# EAGLE design T_Ringmod (EAGLE 6.3)
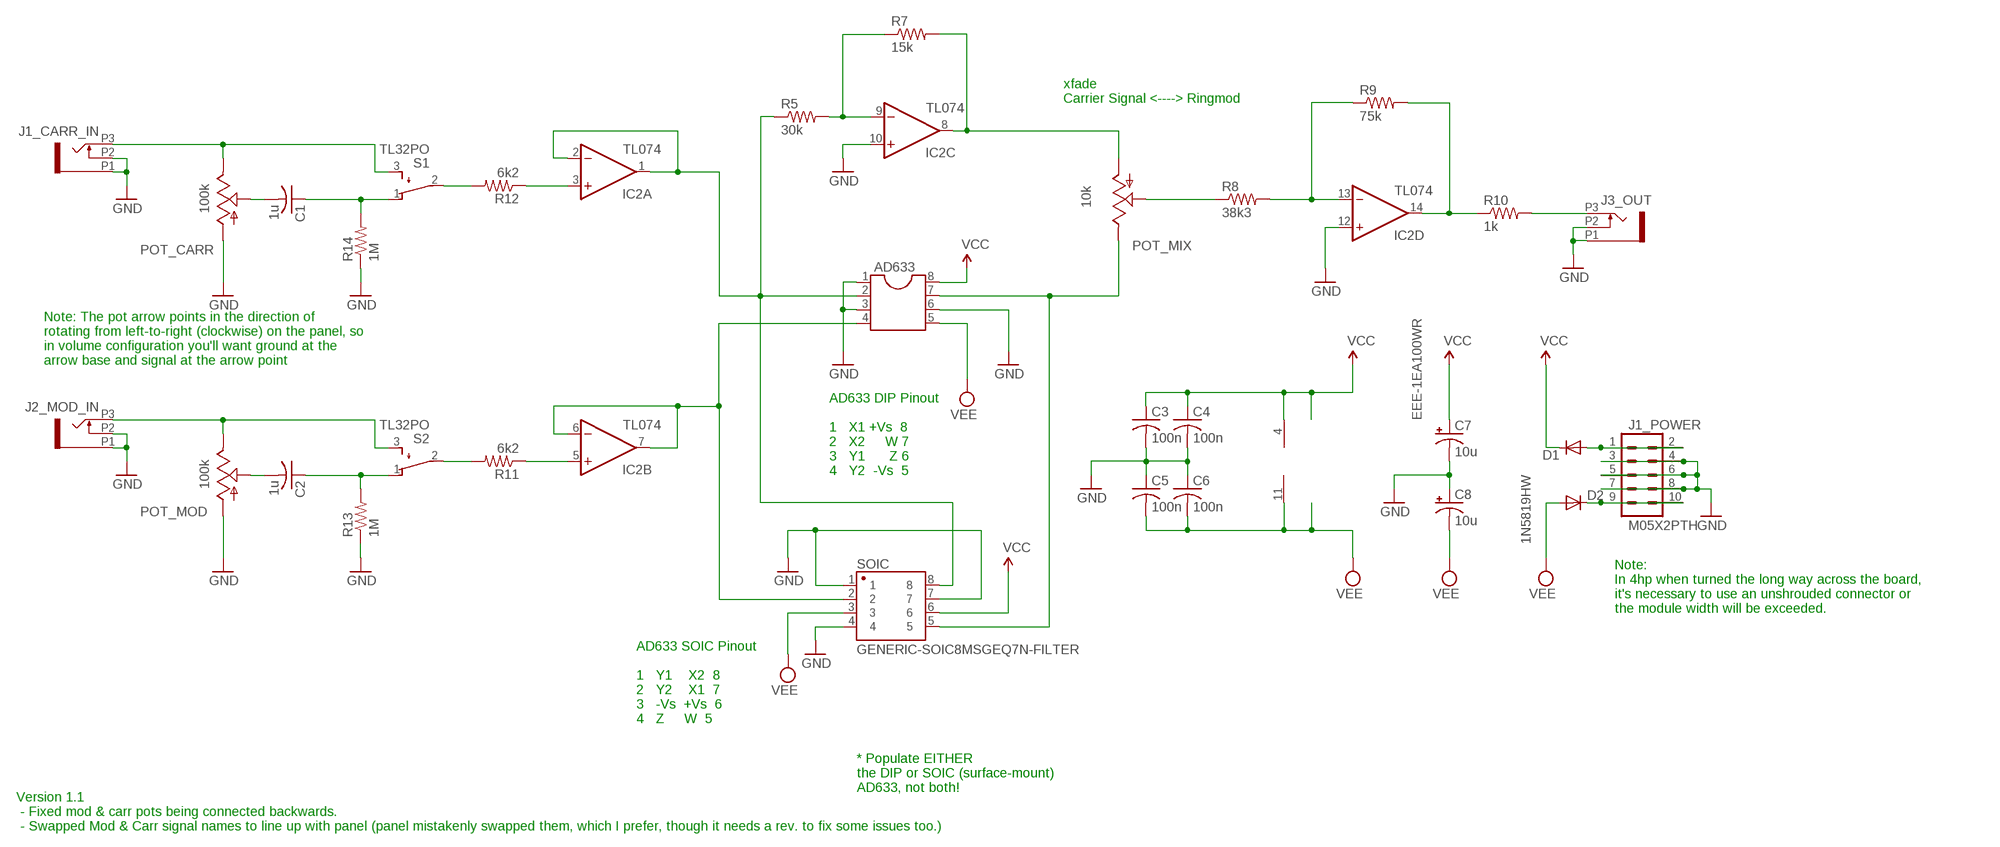
[diagram p0: schematic, sheet 1]

## Parts
AD633  DIL8  [DIL08]
C1  1u  C-USC0805  [C0805]
C2  1u  C-USC0805  [C0805]
C3  100n  C-USC0805  [C0805]
C4  100n  C-USC0805  [C0805]
C5  100n  C-USC0805  [C0805]
C6  100n  C-USC0805  [C0805]
C7  10u  CPOL-USA  [PANASONIC_A]
C8  10u  CPOL-USA  [PANASONIC_A]
D1  1N5819HW  DIODE-SOD123  [SOD123]
D2  1N5819HW  DIODE-SOD123  [SOD123]
IC2  TL074  TL074D  [SO14]
J1_CARR_IN  PJ301_THONKICONN6  [WQP_PJ_301M6]
J1_POWER  M05X2PTH  [AVR_ICSP]
J2_MOD_IN  PJ301_THONKICONN6  [WQP_PJ_301M6]
J3_OUT  PJ301_THONKICONN6  [WQP_PJ_301M6]
POT_CARR  100k  POT_USVERTICAL_PS  [ALPS_POT_VERTICAL_PS]
POT_MIX  10k  POT_USVERTICAL_PS  [ALPS_POT_VERTICAL_PS]
POT_MOD  100k  POT_USVERTICAL_PS  [ALPS_POT_VERTICAL_PS]
R5  30k  R-US_R0805  [R0805]
R7  15k  R-US_R0805  [R0805]
R8  38k3  R-US_R0805  [R0805]
R9  75k  R-US_R0805  [R0805]
R10  1k  R-US_R0805  [R0805]
R11  6k2  R-US_R0805  [R0805]
R12  6k2  R-US_R0805  [R0805]
R13  1M  R-US_R0805  [R0805]
R14  1M  R-US_R0805  [R0805]
S1  TL32PO  [TL3XPO]
S2  TL32PO  [TL3XPO]
SOIC  GENERIC-SOIC8MSGEQ7N-FILTER  [SO08]

## Nets
GND: AD633.1 AD633.3 AD633.6 C3.2 C4.2 C5.1 C6.1 C7.- C8.+ IC2.10(C:+IN) IC2.12(D:+IN) J1_CARR_IN.P1 J1_CARR_IN.P2 J1_POWER.3 J1_POWER.4 J1_POWER.5 J1_POWER.6 J1_POWER.7 J1_POWER.8 J2_MOD_IN.P1 J2_MOD_IN.P2 J3_OUT.P1 J3_OUT.P2 POT_CARR.P$3(A) POT_MOD.P$3(A) R13.1 R14.1 SOIC.1 SOIC.4 SOIC.7
N$1: C2.2 POT_MOD.P$2(S)
N$2: C1.2 POT_CARR.P$2(S)
N$3: C1.1 R14.2 S1.1(O)
N$4: R12.2 S1.2(P)
N$5: IC2.3(A:+IN) R12.1
N$6: D1.A J1_POWER.1 J1_POWER.2
N$7: AD633.2 IC2.1(A:OUT) IC2.2(A:-IN) R5.1 SOIC.8
N$8: IC2.5(B:+IN) R11.1
N$9: R11.2 S2.2(P)
N$10: C2.1 R13.2 S2.1(O)
N$12: AD633.4 IC2.6(B:-IN) IC2.7(B:OUT) SOIC.2
N$13: IC2.9(C:-IN) R5.2 R7.1
N$14: IC2.8(C:OUT) POT_MIX.P$3(A) R7.2
N$15: AD633.7 POT_MIX.P$1(E) SOIC.5
N$16: J2_MOD_IN.P3 POT_MOD.P$1(E) S2.3(S)
N$17: J1_CARR_IN.P3 POT_CARR.P$1(E) S1.3(S)
N$18: POT_MIX.P$2(S) R8.1
N$19: IC2.13(D:-IN) R8.2 R9.1
N$20: D2.C J1_POWER.9 J1_POWER.10
N$21: IC2.14(D:OUT) R9.2 R10.1
N$22: J3_OUT.P3 R10.2
VCC: AD633.8 C3.1 C4.1 C7.+ D1.C IC2.4(P:V+) SOIC.6
VEE: AD633.5 C5.2 C6.2 C8.- D2.A IC2.11(P:V-) SOIC.3

## Notes on the sheet
- xfade
  Carrier Signal <----> Ringmod
- Note: The pot arrow points in the direction of 
  rotating from left-to-right (clockwise) on the panel, so
  in volume configuration you'll want ground at the
  arrow base and signal at the arrow point
- EEE-1EA100WR
- AD633 DIP Pinout
  
  1   X1	+Vs  8
  2   X2	    W 7
  3   Y1	     Z 6
  4   Y2	 -Vs  5
- Note:
  In 4hp when turned the long way across the board,
  it's necessary to use an unshrouded connector or
  the module width will be exceeded.
- AD633 SOIC Pinout
  
  1   Y1	   X2  8
  2   Y2	   X1  7
  3   -Vs	 +Vs  6
  4   Z	    W  5
- Version 1.1
   - Fixed mod & carr pots being connected backwards.
   - Swapped Mod & Carr signal names to line up with panel (panel mistakenly swapped them, which I prefer, though it needs a rev. to fix some issues too.)
- * Populate EITHER
  the DIP or SOIC (surface-mount)
  AD633, not both!

## Library data of the parts
AD633 = ic-package:DIL8: Dual In Line / Socket
C1-C6 = rcl:C-US: CAPACITOR, American symbol
C7 C8 = rcl:CPOL-US: POLARIZED CAPACITOR, American symbol
D1 D2 = diode:DIODE-: DIODE
IC2 = linear:TL074: OP AMP
J1_CARR_IN J2_MOD_IN J3_OUT = og-pj301:PJ301_THONKICONN
J1_POWER = og-header:M05X2: Header 5x2 Standard 10-pin dual row 0.1" header. Commonly used with AVR-ISP. Use with Spark Fun Electronics SKU: PRT-00778
POT_CARR POT_MIX POT_MOD = pot-alps:POT_US
R5 R7-R14 = resistor:R-US_: RESISTOR, American symbol
S1 S2 = switch:TL32PO: TINY SWITCH ON - MOM Source: http://www2.produktinfo.conrad.com/datenblaetter/700000-724999/705152-da-01-de-Subminiaturschalter_TL_36YO.pdf
SOIC = SparkFun-Retired:GENERIC-SOIC8: A placeholder for generic narrow & wide SOIC8 foorptints - used on the DIP adapter board. Has strange reference to IC-10141, a Seven Band Graphic Equalizer Display Filter SOIC-8 VFP: IC-10141; PROD_ID: IC-10141

## Board
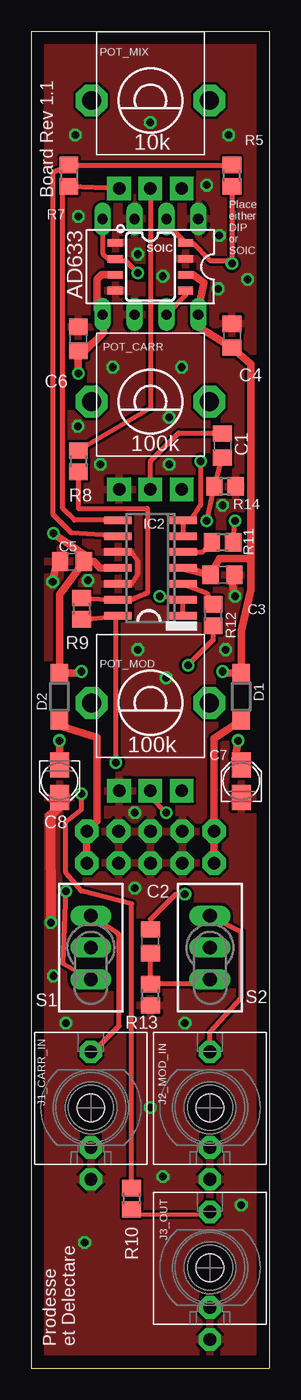
[diagram p1: board, top side]
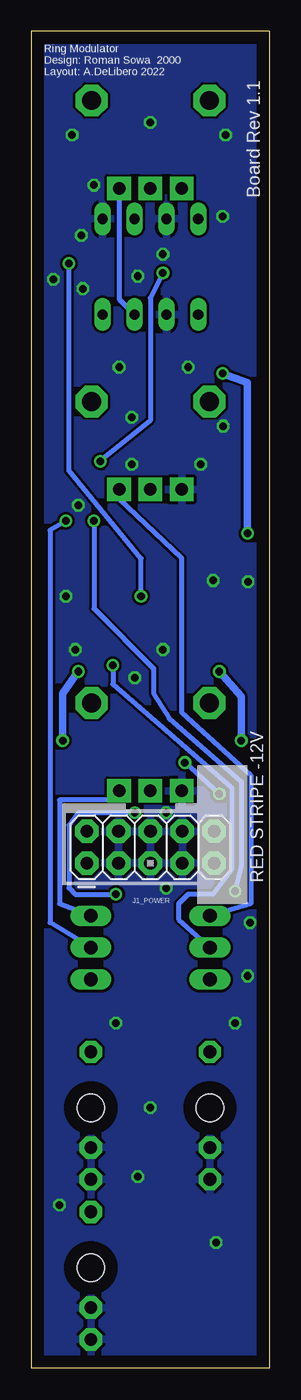
[diagram p2: board, bottom side, seen from below]

Size 19 x 106.5 mm. Coordinates in mm from the lower left corner, seen from the top.
Outline: 0,106.5 0,0 19,0 19,106.5 0,106.5
Copper layers (1*16): Top 0.035mm / dielectric 1.5mm / Bottom 0.035mm
Design rules "default": minimum track width 10mil, minimum drill 24mil, track to track 8mil, track to pad 8mil, pad to pad 8mil, via to via 8mil, smd to smd 8mil, copper to edge 40mil, drill to drill 8mil, minimum pad ring 10mil, minimum via ring 8mil, stop-mask expansion 4mil, vias tented up to drill 0mil, thermal gap 10mil

### Footprints (pad centres in the part's own frame; a part is rotated, then mirrored left to right if it is on the bottom)
DIL08 = drill 0.813 long: 1 -3.81,-3.81; 2 -1.27,-3.81; 3 1.27,-3.81; 4 3.81,-3.81; 5 3.81,3.81; 6 1.27,3.81; 7 -1.27,3.81; 8 -3.81,3.81
C0805 = smd 1.3 x 1.5: 1 -0.95,0; 2 0.95,0
PANASONIC_A = smd 2 x 1.5: + 1.3,0; - -1.3,0
SOD123 = smd 1.4 x 1.4: A 1.9,0; C -1.9,0
SO14 = smd 0.6 x 2.2: 1 -3.81,-2.6; 2 -2.54,-2.6; 3 -1.27,-2.6; 4 0,-2.6; 5 1.27,-2.6; 6 2.54,-2.6; 7 3.81,-2.6; 8 3.81,2.6; 9 2.54,2.6; 10 1.27,2.6; 11 0,2.6; 12 -1.27,2.6; 13 -2.54,2.6; 14 -3.81,2.6
WQP_PJ_301M6 = drill 1.016 pad 1.778 octagon: P1 0,-5.715; P2 0,-3.175; P3 0,4.445 | hole 2.2: 0,0
AVR_ICSP = drill 1.016 pad 1.88 octagon: 1 -1.27,5.08; 2 1.27,5.08; 3 -1.27,2.54; 4 1.27,2.54; 5 -1.27,0; 6 1.27,0; 7 -1.27,-2.54; 8 1.27,-2.54; 9 -1.27,-5.08; 10 1.27,-5.08
ALPS_POT_VERTICAL_PS = drill 1 pad 1.88 square: P$1 -2.5,7; P$2 0,7; P$3 2.5,7 | drill 1.5 pad 2.54 octagon: P$4 -4.7,0; P$5 4.7,0
R0805 = smd 1.3 x 1.5: 1 -0.85,0; 2 0.85,0
TL3XPO = drill 1.1 pad 1.422 long: 1 -2.54,0; 2 0,0; 3 2.54,0
SO08 = smd 0.6 x 1.2: 1 -1.905,-2.8; 2 -0.635,-2.8; 3 0.635,-2.8; 4 1.905,-2.8; 5 1.905,2.8; 6 0.635,2.8; 7 -0.635,2.8; 8 -1.905,2.8

### Placement (x,y rotation side)
AD633  9.5,87.75 180 top
C1  15.25,73.5 90 top
C2  9.5,34 90 top
C3  15.25,63.2 0 top
C4  16,82.25 90 top
C5  3.25,64.25 0 top
C6  3.75,82 270 top
C7  16.75,46.75 90 top
C8  2.25,46.76 270 top
D1  16.75,53.5 270 top
D2  2.25,53.5 90 top
IC2  9.5,63.75 90 top
J1_CARR_IN  4.75,20.75 0 top
J1_POWER  9.5,41.5 90 bottom
J2_MOD_IN  14.25,20.75 0 top
J3_OUT  14.25,8 0 top
POT_CARR  9.5,77 180 top
POT_MIX  9.5,101 180 top
POT_MOD  9.5,53 180 top
R5  16,95 90 top
R7  3,95 270 top
R8  3.75,72.25 270 top
R9  4,60.5 270 top
R10  8,13.5 270 top
R11  15.25,65.8 0 top
R12  14.5,60 270 top
R13  9.5,29.75 90 top
R14  15.45,70.25 180 top
S1  4.75,33.5 90 top
S2  14.25,33.5 90 top
SOIC  9.5,87.75 270 top

### Tracks (layer width: path | path; a pad name or v marks a point on that pad's centre or on a via)
GND  (via drill 0.6)
  Top 0.406: C3.2 15.85,63.4 | C5.1 1.9,63.65 | IC2.12 7.98,62.48 8.5,63.25 8.5,64.25 8,65 8,65.02 IC2.10
  Top 0.61: 15.85,63.4 v16.25,61.5 | 1.9,63.65 v1.7,62.65
  Top 0.813: C8.+ 2.25,44.75 1.5,44 v1.55,35.5
  other vias: 4.25,10 16.75,13 1.75,31.25 2.75,27.5 12.25,27.5 10.5,15.25 8.25,38.25 8.25,44.25 10.75,55 8.5,57.25 4.5,62.75 15.5,57.25 5.5,72 11,72 11,75.75 8.5,88.75 14.9,86 10.5,87 3.75,91.75 3.5,98.25 15.75,98.25 9.5,99.25 15,90.25 14,94.25 6.5,79.75 12,79.75 17.25,86.75 3.7,75.05 9.5,20.75 15.25,68.75
  pour Top: 0,0 0,106.5 19,106.5 19.5,-0.5
  pour Bottom: 0,0 0,106.5 19,106.5 20.5,-2
N$1  (via drill 0.6)
  Top 0.406: POT_MOD.P$2 9.5,45.5 v10.75,44.25 | v12.25,37.75 11.5,37.75 9.5,35.75 C2.2
  Bottom 0.406: v10.75,44.25 15.25,44.25 16,43.25 16,38.25 15.5,37.75 v12.25,37.75
N$2
  Top 0.406: POT_CARR.P$2 9.5,72.25 11.75,74.5 15.2,74.5 C1.2
N$3  (via drill 0.6)
  Top 0.406: 15.45,72.55 C1.1 R14.2 v14,67.5 | v2.75,38 2.5,32.25 2.54,32.25 S1.1
  Bottom 0.406: v14,67.5 14,60.5 9.25,55.75 9.25,53.75 8,51.75 2.25,46.75 2.25,40 v2.75,38
N$4  (via drill 0.6)
  Top 0.406: R12.2 14.5,58 v12.5,56
  Bottom 0.406: v12.5,56 12.5,54.5 3,46.25 3,39.75 4.5,37.75 6.5,37.75 7.25,37 7.25,35.75 S1.2
N$5
  Top 0.406: IC2.3 14,61.75 R12.1
N$6
  Top 0.61: D1.A 14.58,50.18 J1_POWER.2 J1_POWER.1
N$7  (via drill 0.6)
  Top 0.406: R5.1 v16,88 15.75,88.25 14.25,88.25 12.85,89.66 SOIC.8 10.77,91.19 AD633.2 | IC2.1 IC2.2 v10.25,61.5
  Bottom 0.406: v10.25,61.5 10.25,64.5 16,71.5 v16,88
N$8
  Top 0.406: IC2.5 13.67,65.02 R11.1
N$9  (via drill 0.6)
  Top 0.406: R11.2 v16.25,67.5
  Bottom 0.406: S2.2 17.5,35.5 17.5,66.75 v16.25,67.5
N$10
  Top 0.406: S2.1 13.89,30.6 R13.2 C2.1
N$12  (via drill 0.6)
  Top 0.406: v13.5,72.25 13.5,68.75 13,68 12.81,67.56 IC2.7 IC2.6 | AD633.4 5.69,88.81 6.12,88.38 | 6.12,88.38 6.25,88.25 7.5,88.25 v8.5,87.25 | SOIC.2 6.13,88.39 6.12,88.38
  Bottom 0.406: v8.5,87.25 9.5,85.25 9.5,75.5 v13.5,72.25
N$13
  Top 0.406: R5.2 R7.1 1.75,95.25 1.75,68 3.21,66.54 IC2.9
N$14
  Top 0.406: POT_MIX.P$3 R7.2 2.5,93.65 2.5,68.5 3.44,67.56 IC2.8
N$15
  Top 0.406: SOIC.5 12.3,85.47 AD633.7
  Bottom 0.406: POT_MIX.P$1 12,85.17 AD633.7
N$16
  Top 0.406: J2_MOD_IN.P3 14.25,26.75 16.75,29.5 16.75,34.75 S2.3
  Bottom 0.406: S2.3 16.75,37 16.75,45.25 12.75,45.25 POT_MOD.P$1
N$17
  Top 0.406: J1_CARR_IN.P3 4.95,25.2 7,27.25 7,34.5 6.75,34.75 4.79,36 S1.3
  Bottom 0.406: S1.3 1.5,37 1.5,47.25 7,52.25 7,64.5 12,69.25 POT_CARR.P$1
N$18
  Top 0.406: POT_MIX.P$2 9.5,76.5 R8.1
N$19
  Top 0.406: R9.1 IC2.13 7.96,61.21 9.25,61.75 9.25,68.5 3.75,68.5 R8.2
N$20
  Top 0.61: D2.C 2.4,51.1 5.25,50.25 5.25,43.6 J1_POWER.10 J1_POWER.9
N$21  (via drill 0.6)
  Top 0.406: R9.2 IC2.14 6.75,59.79 v6.75,48.25 | R10.1 8,37 4,38 2.75,39.5 2.75,43.5 4,44.5 v4,45.75
  Bottom 0.406: v4,45.75 v6.75,48.25
N$22
  Top 0.305: R10.2 8,12.25 13.55,12.25 J3_OUT.P3
VCC  (via drill 0.6)
  Top 0.406: 17.25,64.5 17.5,64.75 | SOIC.6 12.88,87.11 | 13.25,84 AD633.8
  Top 0.61: IC2.4 C3.1 15,64.5 17.25,64.5 | AD633.8 13.25,83.94 13.25,83 C4.1 17.5,80 17.5,64.75 17.5,62 16.75,58.75 D1.C 15.35,55.4 v15.25,55.5 | C7.+ 16.25,48.55 v16.5,50 | 12.88,87.11 13.75,86.5 13.25,84
  Bottom 0.61: v16.5,50 16.5,53.75 v15.25,55.5
VEE  (via drill 0.6)
  Top 0.61: C5.2 2.25,61.65 D2.A 3.9,55.4 v4,55.5 | C5.2 5,64.25 5.5,63.75 IC2.11 | 5.75,83 5.75,83.94 AD633.5 | v3.75,79.25 C6.2 4.3,81.05 5.75,82.5 5.75,83.88 AD633.5 | C8.- v2.25,50 | C5.2 4.2,64.8 v1.75,66.5 | SOIC.3 5.62,87.11 5.25,86.75 5.25,84.38 AD633.5
  Bottom 0.61: v1.75,66.5 1.75,78.5 v3.75,79.25 | v2.25,50 2.25,53.5 v4,55.5

### Text on the board
tNames: Board Rev 1.1 | Place / either / DIP / or / SOIC | Prodesse / et Delectare
bNames: Ring Modulator / Design: Roman Sowa 2000 / Layout: A.DeLibero 2022 | Board Rev 1.1 | RED STRIPE -12V